# EAGLE design imu_spi (EAGLE 9.6.2)
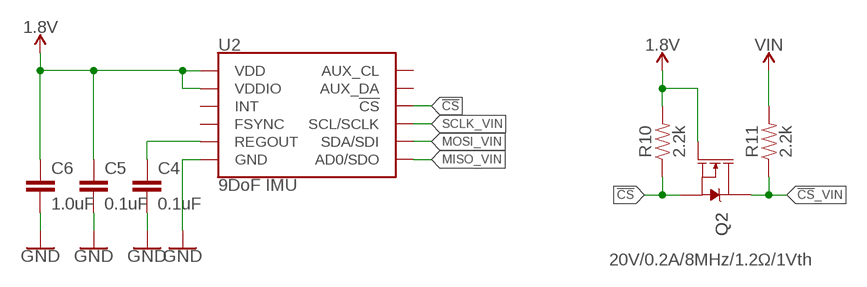
[diagram p0: schematic, sheet 1]

## Parts
C4  0.1uF  C-EUC0402  [C0402]
C5  0.1uF  C-EUC0402  [C0402]
C6  1.0uF  C-EUC0402  [C0402]
Q2  20V/0.2A/8MHz/1.2Ω/1Vth  MOSFET-NCH-RE1C002UN  [SOT-416FL]
R10  2.2k  2.2KOHM-0402T-1/16W-1%  [0402-TIGHT]
R11  2.2k  2.2KOHM-0402T-1/16W-1%  [0402-TIGHT]
U2  9DoF IMU  ICM-20948  [QFN24-3X3]

## Nets
1.8V: C5.1 C6.1 Q2.1(G) R10.2 U2.8(VDDIO) U2.13(VDD)
!CS: Q2.2(S) R10.1 U2.22(!CS)
!CS!_VIN: Q2.3(D) R11.1
GND: C4.2 C5.2 C6.2 U2.18(GND) U2.20(GND)
MISO_VIN: U2.9(AD0/SDO)
MOSI_VIN: U2.24(SDA/SDI)
N$1: C4.1 U2.10(REGOUT)
SCLK_VIN: U2.23(SCL/SCLK)
VIN: R11.2
Unconnected: U2.7(AUX_CL) U2.11(FSYNC) U2.12(INT) U2.21(AUX_DA)

## Library data of the parts
C4-C6 = rcl:C-EU: CAPACITOR, European symbol; SPICEPREFIX: C
Q2 = SparkFun-DiscreteSemi:MOSFET-NCH: N-channel MOSFETs Voltage controlled devices that allow control of high current outputs. SparkFun Products: SparkFun OpenScale <https://www.sparkfun.com/products/13261> SparkFun Digital Sandbox <https://www.sparkfun.com/products/12651> SparkFun Monster Moto Shield <https://www.sparkfun.com/products/10182> SparkFun MOSFET Power Controller <https://www.sparkfun.com/products/11214>; PROD_ID: TRANS_14399
R10 R11 = SparkFun-Resistors:2.2KOHM: 2.2kΩ resistor A resistor is a passive two-terminal electrical component that implements electrical resistance as a circuit element. Resistors act to reduce current flow, and, at the same time, act to lower voltage levels within circuits. - Wikipedia; PROD_ID: RES-14341
U2 = SparkFun-Sensors:ICM-20948: ICM-20948 9 Degree of Freedom IMU World’s lowest power 9-axis MotionTracking device that is ideally suited for smartphones, tablets, wearable sensors, and IoT applications. Includes onboard Digital Motion Processor to offload computations from the host processor Datasheet <https://cdn.sparkfun.com/assets/learn_tutorials/5/5/0/MPU9250REV1.0.pdf> SparkFun Products: SparkFun IMU Breakout - ICM-20948 <https://www.sparkfun.com/products/15182>; PROD_ID: IC-14247

## Board
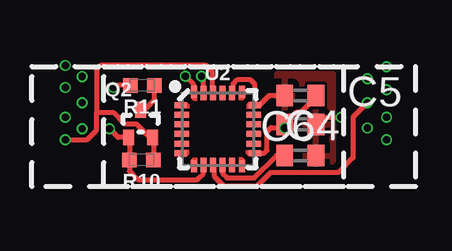
[diagram p1: board, top side]
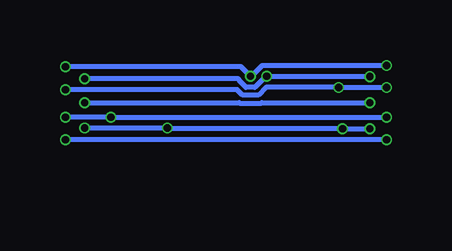
[diagram p2: board, bottom side, seen from below]

No outline drawn. Coordinates in mm, seen from the top.
Copper layers (1*16): Top 0.035mm / dielectric 1.6mm / Bottom 0.035mm
Design rules "jlcpcb-2layers": minimum track width 5mil, minimum drill 0.3mm, track to track 5mil, track to pad 5mil, pad to pad 5mil, via to via 5mil, smd to smd 5mil, copper to edge 0.2mm, drill to drill 6mil, minimum pad ring 10mil, minimum via ring 3mil, stop-mask expansion 4mil, vias tented up to drill 0mil, thermal gap 10mil

### Footprints (pad centres in the part's own frame; a part is rotated, then mirrored left to right if it is on the bottom)
C0402 = smd 0.7 x 0.9: 1 -0.65,0; 2 0.65,0
SOT-416FL = smd 0.46 x 0.65: 1 -0.5,-1.1; 2 0.5,-1.1; 3 0,0.05
0402-TIGHT = smd 0.6 x 0.6: 1 -0.5,0; 2 0.5,0
QFN24-3X3 = smd 0.495 x 0.25: 1 -1.552,1; 6 -1.552,-1; 13 1.552,-1; 18 1.552,1 | smd 0.6 x 0.25: 2 -1.5,0.6; 3 -1.5,0.2; 4 -1.5,-0.2; 5 -1.5,-0.6; 14 1.5,-0.6; 15 1.5,-0.2; 16 1.5,0.2; 17 1.5,0.6 | smd 0.25 x 0.495: 7 -1,-1.552; 12 1,-1.552; 19 1,1.552; 24 -1,1.552 | smd 0.25 x 0.6: 8 -0.6,-1.5; 9 -0.2,-1.5; 10 0.2,-1.5; 11 0.6,-1.5; 20 0.6,1.5; 21 0.2,1.5; 22 -0.2,1.5; 23 -0.6,1.5

### Placement (x,y rotation side)
C4  6.2,2.3 0 top
C5  6.2,3.6 0 top
C6  6.2,4.8 180 top
Q2  -0.46,4.16 0 top
R10  -0.43,2.12 180 top
R11  -0.39,5.22 180 top
U2  2.76,3.4 0 top

### Tracks (layer width: path | path; a pad name or v marks a point on that pad's centre or on a via)
1.8V  (via drill 0.3)
  Top 0.203: U2.13 4.7,2.4 4.81,2.51 4.81,3.3 4.98,3.46 5.53,3.46 | C6.1 6.85,4.72 6.25,4.12 6.07,4.12 C5.1 5.53,3.58 5.53,3.46 | v-1.76,3.42 -1.4,3.06 Q2.1 -0.93,3.03 R10.2 -0.93,1.66 -0.57,1.3 1.9,1.3 1.97,1.37 1.98,1.37 2.16,1.55 U2.8 | 5.53,3.46 v5.55,3.44
  Bottom 0.203: v-2.9,3.42 v-1.76,3.42 5.52,3.42 v5.55,3.44 v9,3.44
!CS  (via drill 0.3)
  Top 0.203: R10.1 0.07,3.03 Q2.2 -0.08,3.06 -0.64,3.61 -1.11,3.61 -1.57,4.07 -2.27,4.07 -2.3,4.1 | U2.22 2.53,4.93 2.53,5.79 2.27,6.05 -2.15,6.05 -2.3,5.9 -2.3,4.1 | v-3.6,2.96 -2.7,2.96 -2.3,3.36 -2.3,4.1
  Bottom 0.203: v-3.6,2.96 v9.8,2.96
!CS!_VIN
  Top 0.203: R11.1 0.11,4.61 -0.29,4.21 Q2.3
GND  (via drill 0.3)
  Top 0.203: U2.20 3.4,4.95 3.4,5.29 3.58,5.47 4.1,5.47 4.3,5.27 4.3,4.41 U2.18 4.5,4.4 4.9,4.8 C6.2 | C5.2 7.15,3.9 v7.9,3.9
  Bottom 0.203: v-3.6,3.9 v7.9,3.9 v9.8,3.9
  pour Top: 5.2,5.4 5.2,4.3 5.9,4.3 5.9,5.1 6,5.2 6.1,5.3 7.2,5.3 7.2,4.2 6.6,4.2 6.5,4.1 6.4,4 6.4,2 6.5,1.9 7.4,1.9 7.6,2.1 7.6,5.7 5.2,5.7
MISO_VIN  (via drill 0.3)
  Top 0.203: U2.9 2.61,1.85 2.61,1.44 3,1.04 4.41,1.04 4.97,1.6 7.8,1.6 8.4,2.2 8.4,3.9 v9,4.5
  Bottom 0.203: v9,4.5 2.56,4.5 2.54,4.49 1.62,4.49 1.6,4.5 v-2.9,4.5
MOSI_VIN  (via drill 0.3)
  Top 0.203: U2.24 1.76,5.24 v1.4,5.6
  Bottom 0.203: v-2.9,5.59 v1.39,5.59 v1.4,5.6 1.44,5.6 1.89,5.14 2.27,5.14 2.53,5.41 2.53,5.43 2.6,5.5 v9,5.5
N$1
  Top 0.203: U2.10 2.96,1.55 3.14,1.37 4.27,1.37 5.2,2.3 C4.1
SCLK_VIN  (via drill 0.3)
  Top 0.203: U2.23 2.16,5.52 v2.08,5.6
  Bottom 0.203: v9.8,6 9.7,6 2.48,6 v2.08,5.6 2.04,5.6 1.59,6.05 v-3.6,6.05
VIN  (via drill 0.3)
  Top 0.203: R11.2 -1.51,5.22 v-1.6,5.13
  Bottom 0.203: v-3.6,5.13 v-1.6,5.13 1.43,5.13 1.75,4.82 2.4,4.82 2.63,5.04 v9.8,5.04